# EAGLE design Retro Adapter V2 1.0 (EAGLE 5.04)
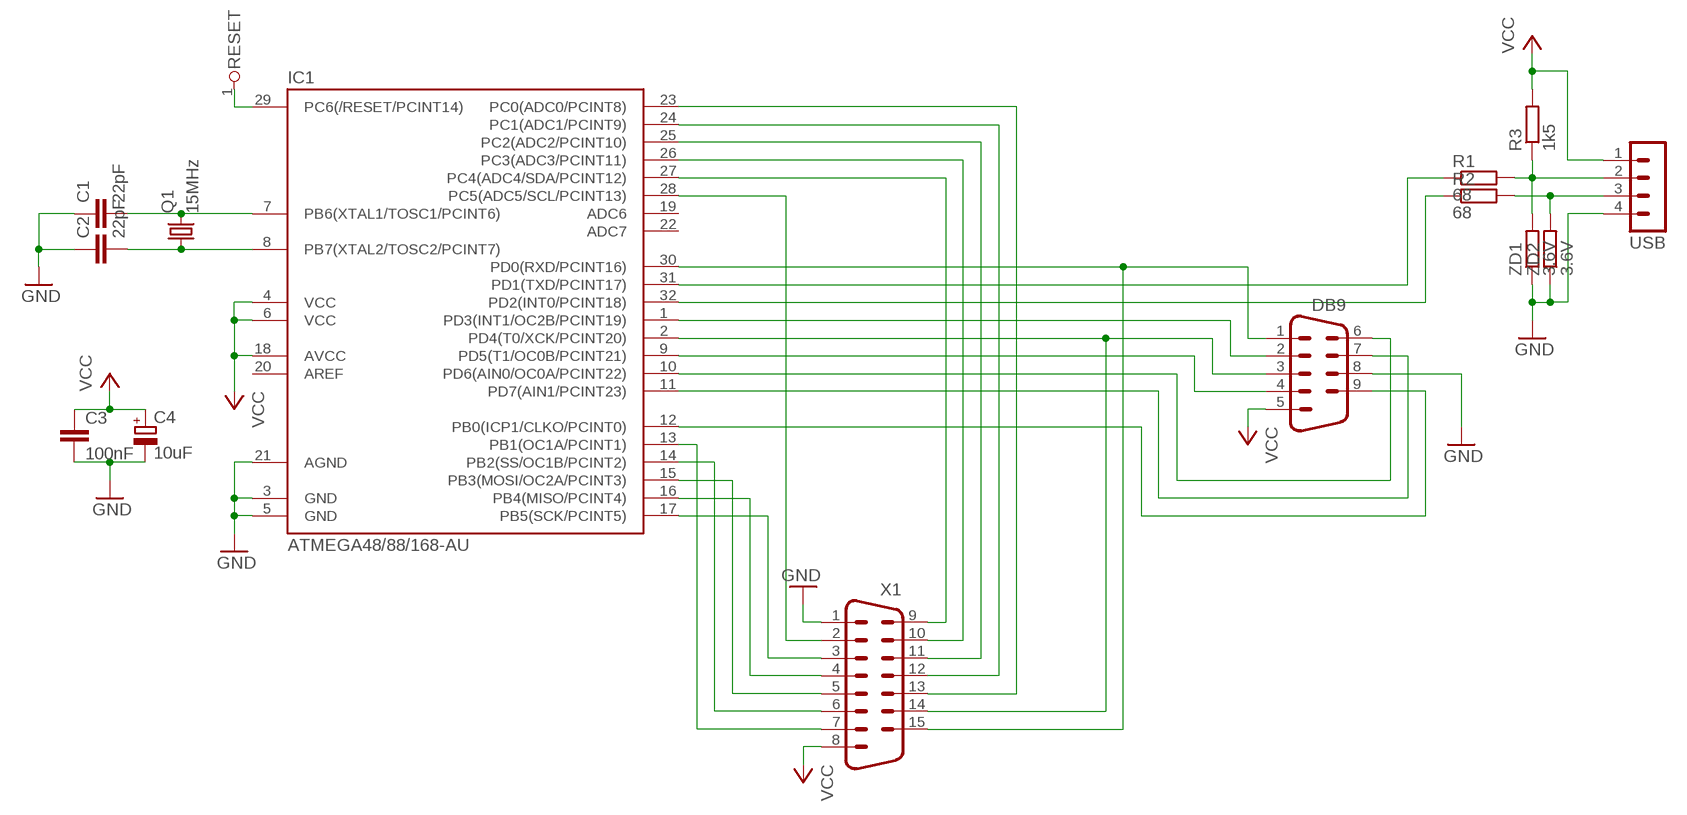
[diagram p0: schematic, sheet 1]

## Parts
C1  22pF  C-EU025-025X050  [C025-025X050]
C2  22pF  C-EU025-025X050  [C025-025X050]
C3  100nF  C-EU025-025X050  [C025-025X050]
C4  10uF  CPOL-EUE2,5-6E  [E2,5-6E]
DB9  M09D  [M09D]
IC1  ATMEGA48/88/168-AU  [TQFP32-08]
Q1  15MHz  CRYSTALHC49S  [HC49/S]
R1  68  R-EU_0204/5  [0204/5]
R2  68  R-EU_0204/5  [0204/5]
R3  1k5  R-EU_0204/5  [0204/5]
RESET  PINHD-1X1  [1X01]
USB  MA04-1  [MA04-1]
X1  M15D  [M15D]
ZD1  3.6V  R-EU_0204/5  [0204/5]
ZD2  3.6V  R-EU_0204/5  [0204/5]

## Nets
GND: C1.1 C2.1 C3.2 C4.- DB9.8 IC1.3(GND) IC1.5(GND) IC1.21(AGND) USB.4 X1.1 ZD1.1 ZD2.1
N$1: C1.2 IC1.7(PB6(XTAL1/TOSC1/PCINT6)) Q1.2
N$2: C2.2 IC1.8(PB7(XTAL2/TOSC2/PCINT7)) Q1.1
N$3: IC1.28(PC5(ADC5/SCL/PCINT13)) X1.2
N$4: IC1.29(PC6(/RESET/PCINT14)) RESET.1
N$5: DB9.3 IC1.2(PD4(T0/XCK/PCINT20)) X1.14
N$6: DB9.1 IC1.30(PD0(RXD/PCINT16)) X1.15
N$7: DB9.6 IC1.10(PD6(AIN0/OC0A/PCINT22))
N$8: IC1.31(PD1(TXD/PCINT17)) R1.1
N$9: DB9.7 IC1.11(PD7(AIN1/PCINT23))
N$10: IC1.27(PC4(ADC4/SDA/PCINT12)) X1.9
N$11: IC1.32(PD2(INT0/PCINT18)) R2.1
N$12: R1.2 R3.1 USB.2 ZD1.2
N$13: R2.2 USB.3 ZD2.2
N$14: IC1.17(PB5(SCK/PCINT5)) X1.3
N$15: IC1.16(PB4(MISO/PCINT4)) X1.4
N$16: DB9.9 IC1.12(PB0(ICP1/CLKO/PCINT0))
N$17: IC1.14(PB2(SS/OC1B/PCINT2)) X1.6
N$18: IC1.13(PB1(OC1A/PCINT1)) X1.7
N$20: IC1.15(PB3(MOSI/OC2A/PCINT3)) X1.5
N$21: IC1.26(PC3(ADC3/PCINT11)) X1.10
N$22: IC1.25(PC2(ADC2/PCINT10)) X1.11
N$23: IC1.24(PC1(ADC1/PCINT9)) X1.12
N$24: IC1.23(PC0(ADC0/PCINT8)) X1.13
N$25: DB9.2 IC1.1(PD3(INT1/OC2B/PCINT19))
N$26: DB9.4 IC1.9(PD5(T1/OC0B/PCINT21))
VCC: C3.1 C4.+ DB9.5 IC1.4(VCC) IC1.6(VCC) IC1.18(AVCC) R3.2 USB.1 X1.8
Unconnected: IC1.19(ADC6) IC1.20(AREF) IC1.22(ADC7)

## Library data of the parts
C1-C3 = rcl:C-EU: CAPACITOR, European symbol
C4 = rcl:CPOL-EU: POLARIZED CAPACITOR, European symbol
DB9 = con-subd:M09: SUB-D
IC1 = atmega8:ATMEGA48/88/168
Q1 = crystal:CRYSTAL: CRYSTAL
R1-R3 ZD1 ZD2 = rcl:R-EU_: RESISTOR, European symbol
RESET = mojo:PINHD-1X1: PIN HEADER
USB = con-lstb:MA04-1: PIN HEADER
X1 = con-subd:M15: SUB-D

## Board
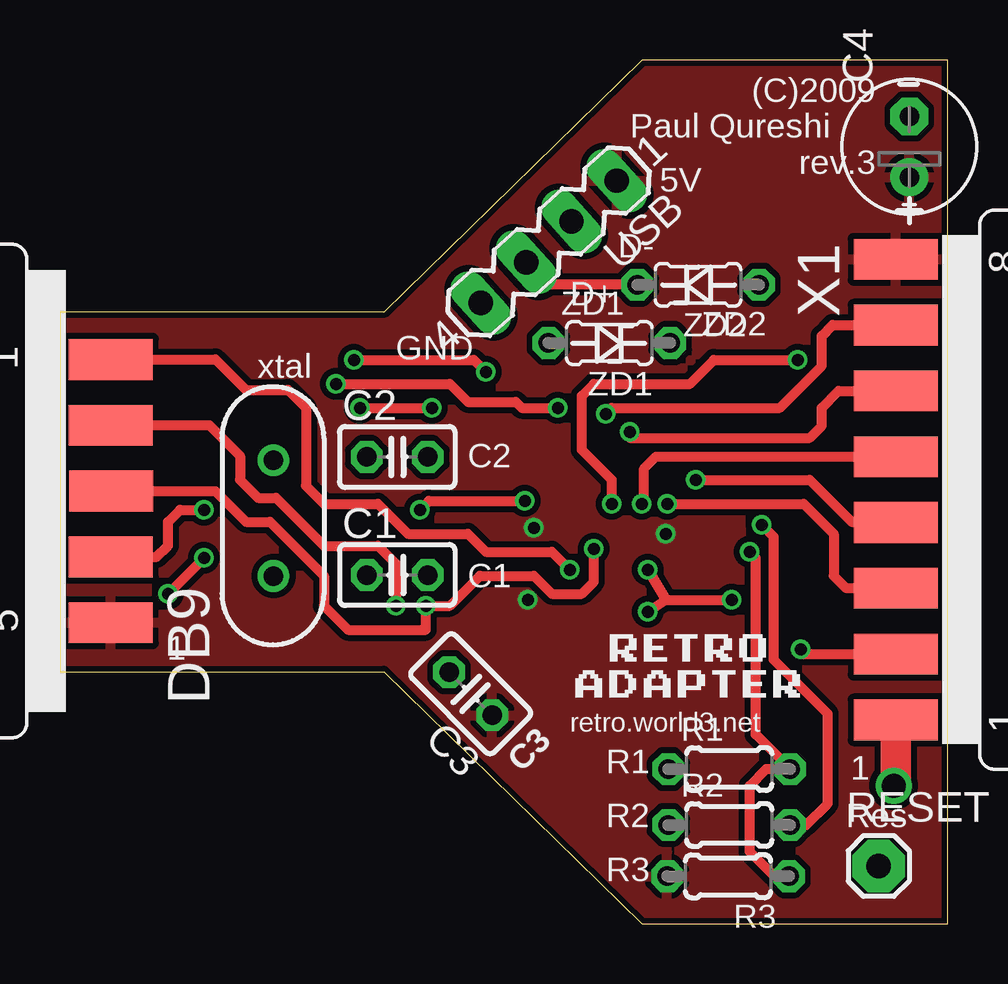
[diagram p1: board, top side]
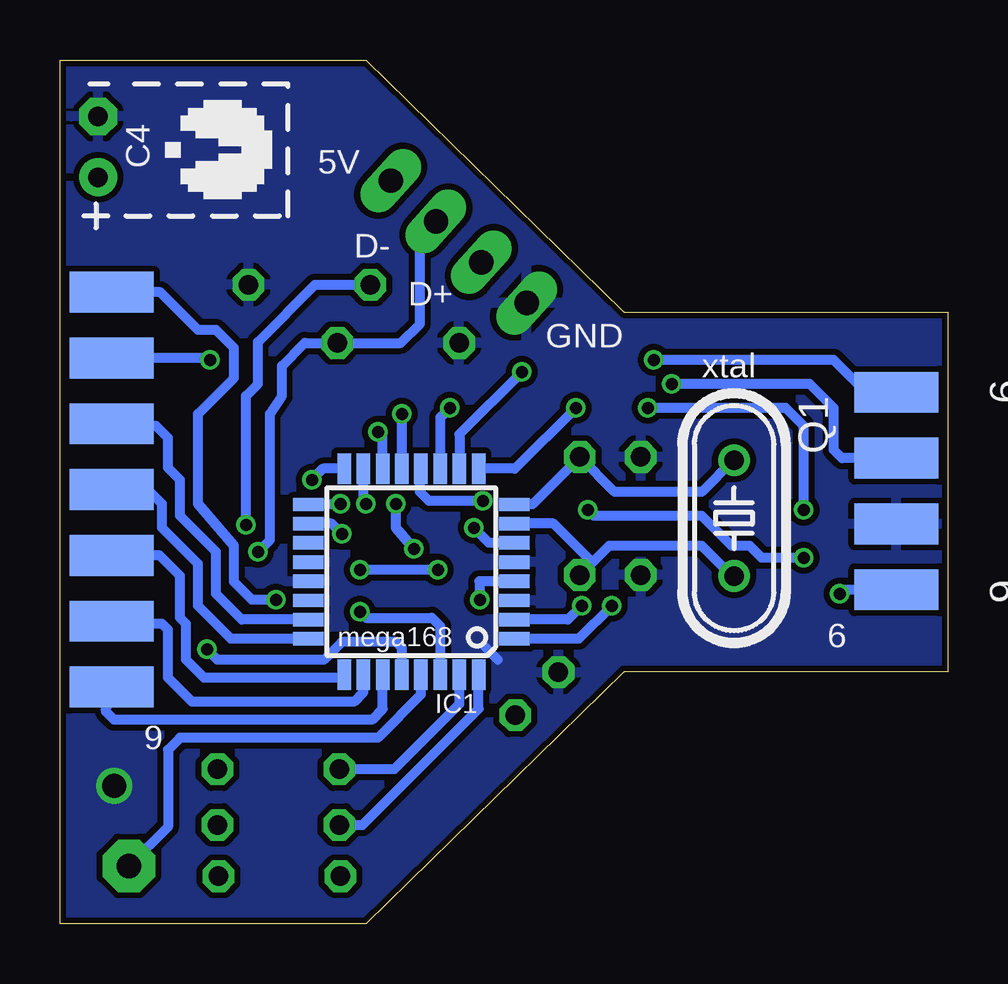
[diagram p2: board, bottom side, seen from below]

Size 37 x 36 mm. Coordinates in mm from the lower left corner, seen from the top.
Outline: 0,10.5 13.5,10.5 24.25,0 37,0 37,36 24.25,36 13.5,25.5 0,25.5 0,10.5
Copper layers (1*16): Top 0.035mm / dielectric 1.5mm / Bottom 0.035mm
Design rules "rule_manufacture_limit": minimum track width 8mil, minimum drill 12mil, track to track 6mil, track to pad 6mil, pad to pad 6mil, via to via 10mil, smd to smd 0mil, copper to edge 10mil, drill to drill 10mil, minimum pad ring 10mil, minimum via ring 6mil, stop-mask expansion 2mil, vias tented up to drill 25mil, thermal gap 10mil

### Footprints (pad centres in the part's own frame; a part is rotated, then mirrored left to right if it is on the bottom)
C025-025X050 = drill 0.813 octagon: 1 -1.27,0; 2 1.27,0
E2,5-6E = drill 0.813 pad 1.575 round: + -1.27,0 | drill 0.813 pad 1.575 octagon: - 1.27,0
M09D = smd 1.7 x 3.5: 1 5.486,-6.045; 2 2.743,-6.045; 3 0,-6.045; 4 -2.743,-6.045; 5 -5.486,-6.045 | smd 1.7 x 3.5 bottom: 6 4.115,-6.045; 7 1.372,-6.045; 8 -1.372,-6.045; 9 -4.115,-6.045
TQFP32-08 = smd 1.27 x 0.559: 1 -4.293,2.8; 2 -4.293,2; 3 -4.293,1.2; 4 -4.293,0.4; 5 -4.293,-0.4; 6 -4.293,-1.2; 7 -4.293,-2; 8 -4.293,-2.8; 17 4.293,-2.8; 18 4.293,-2; 19 4.293,-1.2; 20 4.293,-0.4; 21 4.293,0.4; 22 4.293,1.2; 23 4.293,2; 24 4.293,2.8 | smd 0.559 x 1.27: 9 -2.8,-4.293; 10 -2,-4.293; 11 -1.2,-4.293; 12 -0.4,-4.293; 13 0.4,-4.293; 14 1.2,-4.293; 15 2,-4.293; 16 2.8,-4.293; 25 2.8,4.293; 26 2,4.293; 27 1.2,4.293; 28 0.4,4.293; 29 -0.4,4.293; 30 -1.2,4.293; 31 -2,4.293; 32 -2.8,4.293
HC49/S = drill 0.813 round: 1 -2.413,0; 2 2.413,0
0204/5 = drill 0.813 octagon: 1 -2.54,0; 2 2.54,0
1X01 = drill 1.016 pad 2.184 octagon: 1 0,0
MA04-1 = drill 1.016 long: 1 -3.81,0; 2 -1.27,0; 3 1.27,0; 4 3.81,0
M15D = smd 1.7 x 3.5: 1 9.601,-6.045; 2 6.858,-6.045; 3 4.115,-6.045; 4 1.372,-6.045; 5 -1.372,-6.045; 6 -4.115,-6.045; 7 -6.858,-6.045; 8 -9.601,-6.045 | smd 1.7 x 3.5 bottom: 9 8.23,-6.045; 10 5.486,-6.045; 11 2.743,-6.045; 12 0,-6.045; 13 -2.743,-6.045; 14 -5.486,-6.045; 15 -8.23,-6.045

### Placement (x,y rotation side)
C1  14.06,14.53 0 top
C2  14.06,19.45 0 top
C3  17.12,9.58 135 top
C4  35.41,32.38 90 top
DB9  -3.92,18.03 90 top
IC1  22.35,14.67 180 bottom
Q1  8.9,16.9 270 bottom
R1  27.9,6.44 0 top
R2  27.9,4.11 0 top
R3  27.85,1.97 180 top
RESET  34.13,2.4 0 top
USB  20.38,28.42 222 top
X1  40.88,18.09 270 top
ZD1  22.9,24.2 0 top
ZD2  26.6,26.63 180 top

### Tracks (layer width: path | path; a pad name or v marks a point on that pad's centre or on a via)
GND  (via drill 1)
  Top 1.27: X1.1 34.84,6.08 v34.75,5.75
  Bottom 0.406: 19.25,11.5 18.75,11
  pour Bottom (isolate 0.254): 0,25.75 0,10.5 13.25,10.5 24,0 37.5,0 37.5,36.25 24.75,36.25 13.5,25.75
N$1
  Bottom 0.406: Q1.2 8.99,14.49 10.25,15.75 14.11,15.75 14.8,15.05 | 14.8,15.05 C1.2 | IC1.7 16.42,16.67 14.8,15.05
N$2
  Bottom 0.406: IC1.8 17.31,17.47 C2.2 13.88,18 10.25,18 8.94,19.31 Q1.1
N$3  (via drill 0.5)
  Top 0.406: X1.2 31.02,11.23 v30.88,11.44
  Bottom 0.406: IC1.28 22.75,11.5 23,11.75 25.25,11.75 26,11 30.44,11 v30.88,11.44
N$4
  Bottom 0.406: IC1.29 21.95,9.55 23.75,7.75 32,7.75 32.5,7.25 32.5,4.03 RESET.1
N$5  (via drill 0.5)
  Top 0.406: DB9.3 6.47,18.03 7.75,16.75 8.75,16.75 11,14.5 11,13.25 12,12.25 15.25,12.25 v15.25,13.25 16.25,13.25 17.5,14.5 19.75,14.5 20.5,13.75 21.75,13.75 22.25,14.25 v22.25,15.62 | v30.75,23.5 27.25,23.5 26.25,22.5 22.25,22.5 21.75,22 21.75,19.75 23,18.5 v23,17.5
  Bottom 0.406: IC1.2 15.83,12.67 v15.25,13.25 | X1.14 30.83,23.58 v30.75,23.5 | v23,17.5 23,16.5 v22.25,15.62
N$6  (via drill 0.5)
  Top 0.406: DB9.1 6.48,23.52 7.75,22.25 9.5,22.25 10.25,21.5 10.25,18.25 11,17.5 13.25,17.5 14.5,16.25 17,16.25 17.75,15.5 20.5,15.5 v21.25,14.75 | 25.25,13.5 v24.5,13 | v24.5,14.75 25.25,13.5 | 25.25,13.5 v28,13.5
  Bottom 0.406: X1.15 32.82,26.32 31.25,24.75 30.5,24.75 29.75,24 29.75,22.75 31.25,21.25 31.25,17.5 29.75,15.75 29.75,14.25 29,13.5 v28,13.5 | IC1.30 21.15,12.4 21.5,12.75 24.25,12.75 v24.5,13 | v21.25,14.75 v24.5,14.75
N$7  (via drill 0.5)
  Top 0.406: v12.25,23.5 17.25,23.5 v17.75,23
  Bottom 0.406: IC1.10 20.35,20.4 v17.75,23 | v12.25,23.5 4.75,23.5 3.5,22.25 2.23,22.25 DB9.6
N$8
  Bottom 0.406: IC1.31 20.35,9.15 23.06,6.44 R1.1
N$9  (via drill 0.5)
  Top 0.406: v20.75,21.5 19.25,21.5 19,21.75 17,21.75 16.25,22.5 v11.5,22.5
  Bottom 0.406: IC1.11 21.15,21.1 v20.75,21.5 | DB9.7 4.4,19.4 4.75,19.75 4.75,21.5 5.75,22.5 v11.5,22.5
N$10
  Bottom 0.406: IC1.27 23.55,8.95 24,8.5 34.75,8.5 35.09,8.84 X1.9
N$11
  Bottom 0.406: IC1.32 19.55,8.95 24.39,4.11 R2.1
N$12  (via drill 0.5)
  Top 0.406: R3.1 30.36,2 29.75,2 28.75,3 28.75,5.75 29.44,6.44 R1.2 29,7.88 29,15.25 v28.75,15.5
  Bottom 0.406: v28.75,15.5 28.25,16 28.25,21.25 27.75,22 27.75,23.25 26.8,24.2 ZD1.2 22.8,24.2 22,25 22,28.59 USB.2
N$13  (via drill 0.5)
  Top 0.406: R2.2 31.11,4.11 32,5 32,8.75 29.75,11 29.75,16.12 v29.25,16.62 | ZD2.2 20.38,26.63 USB.3
  Bottom 0.406: v29.25,16.62 29.25,22 28.75,22.5 28.75,24.25 26.37,26.63 ZD2.2
N$14  (via drill 0.5)
  Top 0.406: X1.3 35.06,14 32.75,14 32.25,14.5 32.25,16.25 31,17.5 v25.31,17.5
  Bottom 0.406: IC1.17 25.34,17.47 v25.31,17.5
N$15  (via drill 0.5)
  Top 0.406: v26.5,18.5 31.25,18.5 33,16.75 35.05,16.75 X1.4
  Bottom 0.406: IC1.16 26.04,18.96 v26.5,18.5
N$16  (via drill 0.5)
  Top 0.406: v4.5,13.75 v6,15.25 | 15.12,17.38 v15,17.25 15.38,17.62 v19.38,17.62
  Bottom 0.406: 22,19.01 IC1.12 22,18.91 22,18 21.62,17.62 v19.38,17.62 | v15,17.25 14.75,17 10.25,17 9,15.75 8.25,15.75 7.75,15.25 v6,15.25 | DB9.9 4.33,13.91 v4.5,13.75
N$17  (via drill 0.5)
  Top 0.406: X1.6 32.45,22.2 31.75,21.5 31.75,20.75 31.25,20.25 23.75,20.25 v23.75,20.5
  Bottom 0.406: IC1.14 23.55,20.45 v23.75,20.5
N$18  (via drill 0.5)
  Top 0.406: X1.7 32.2,24.95 31.75,24.5 31.75,23.25 30,21.5 23,21.5 v22.75,21.25
  Bottom 0.406: IC1.13 v22.75,21.25
N$20  (via drill 0.5)
  Top 0.406: X1.5 24.85,19.46 IC1.15 24.35,17.65 v24.25,17.5
  Bottom 0.406: IC1.15 24.35,17.65 v24.25,17.5
N$21
  Bottom 0.406: IC1.26 24.35,9.65 24.75,9.25 31.5,9.25 32.5,10.25 32.5,12.25 32.75,12.5 33.25,12.5 33.35,12.6 X1.10
N$22
  Bottom 0.406: X1.11 32.85,15.35 32,14.5 32,12.75 31.75,12.5 31.75,11 31,10.25 25.28,10.25 IC1.25
N$23
  Bottom 0.406: IC1.24 29.87,11.87 31.25,13.25 31.25,15 32.75,16.5 32.75,17.5 33.25,18 34.99,18 X1.12
N$24
  Bottom 0.406: IC1.23 29.42,12.67 30.5,13.75 30.5,15.5 32,17 32,18.5 32.5,19 32.5,20.25 33,20.75 35,20.75 X1.13
N$25  (via drill 0.5)
  Top 0.406: DB9.2 6.23,20.77 7.5,19.5 7.5,18.5 8.25,17.75 9,17.75 11,15.75 13.25,15.75 14,15 v14,13.25
  Bottom 0.406: IC1.1 15.38,11.87 v14,13.25
N$26  (via drill 0.5)
  Top 0.406: DB9.4 4.04,15.29 4.5,15.75 4.5,16.75 5,17.25 v6,17.25 | v12.5,21.5 v15.5,21.5
  Bottom 0.406: IC1.9 18.04,18.96 v15.5,21.5 | v12.5,21.5 6.75,21.5 6,20.75 v6,17.25
VCC  (via drill 0.5)
  Bottom 0.406: IC1.6 19.12,15.87 v19.75,16.5 | v19.5,13.5 19.52,14.27 IC1.4 | IC1.18 25.67,16.67 v25.25,16.25
  pour Top (isolate 0.254): 0,25.67 13.31,25.67 24.77,36.35 37.47,36.35 37.47,0 24.13,0 13.38,10.54 0,10.54

### Text on the board
_tplace: (C)2009 | Paul Qureshi | rev.3 | 5V | D- | D+ | xtal | GND | ZD2 | ZD1 | C2 | C1 | 1 | retro.world3.net | 1 | C3 | R1 | R2 | Res | R3
_bplace: C4 | 5V | D- | D+ | GND | xtal | 6 | mega168 | 9